# Altium schematic sheet TPA2005D1 D Audio amplifier.SchDoc
size A4
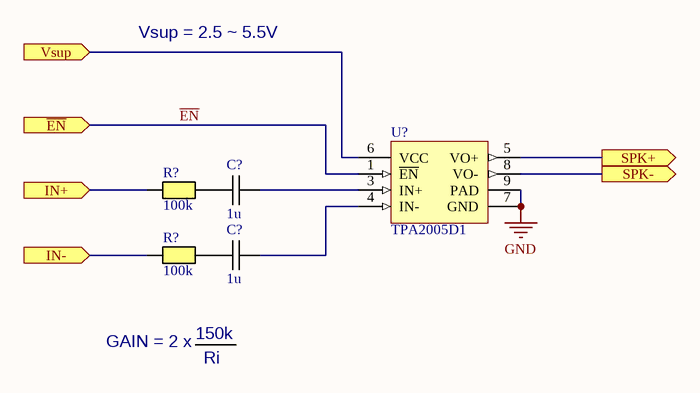
[diagram p0: TPA2005D1 D Audio amplifier.SchDoc]

## Parts
(Parts that share a designator on the sheet are numbered #1, #2 ... from top to bottom, then left to right.)
C?#1  1u  [CAPC0805(2012)75_N]
C?#2  1u  [CAPC0805(2012)75_N]
R?#1  100k  [RESC0603(1608)_N]
R?#2  100k  [RESC0603(1608)_N]
U?  TPA2005D1  [MSOP8_T]

## Ports
IN+ (in), IN- (in), SPK+ (out), SPK- (out), Vsup (in), ~{EN} (in)

## Nets
GND: U?.7(GND) U?.9(PAD)
~{EN}: U?.1(~{EN}) ; port ~{EN}
IN+: R?#1.1 ; port IN+
IN-: R?#2.1 ; port IN-
SPK+: U?.5(VO+) ; port SPK+
SPK-: U?.8(VO-) ; port SPK-
Vsup: U?.6(VCC) ; port Vsup
NetC?#1_1: C?#1.1 U?.3(IN+)
NetC?#1_2: C?#1.2 R?#1.2
NetC?#2_1: C?#2.1 U?.4(IN-)
NetC?#2_2: C?#2.2 R?#2.2

## Notes on the sheet
- Vsup = 2.5 ~ 5.5V
- GAIN = 2 x
- 150k
- Ri

## Library data of the parts
C?#1 C?#2 = Capacitor M: Ceramic capacitor Medium density; Value: 1u
R?#1 R?#2 = Resistor M: Resistor Medium Density; Value: 100k
U? = TPA2005D1: 1.4-W high efficiency filter-free class-D audio power amplifier; Supply Voltage: 2.5 ~ 5.5